# Altium schematic sheet MCU.SchDoc: STM32F3 Microcontroller
size A; DrawnBy: Brent; DocumentNumber: XXXXXX; Revision: A; SheetNumber: 2; SheetTotal: 8
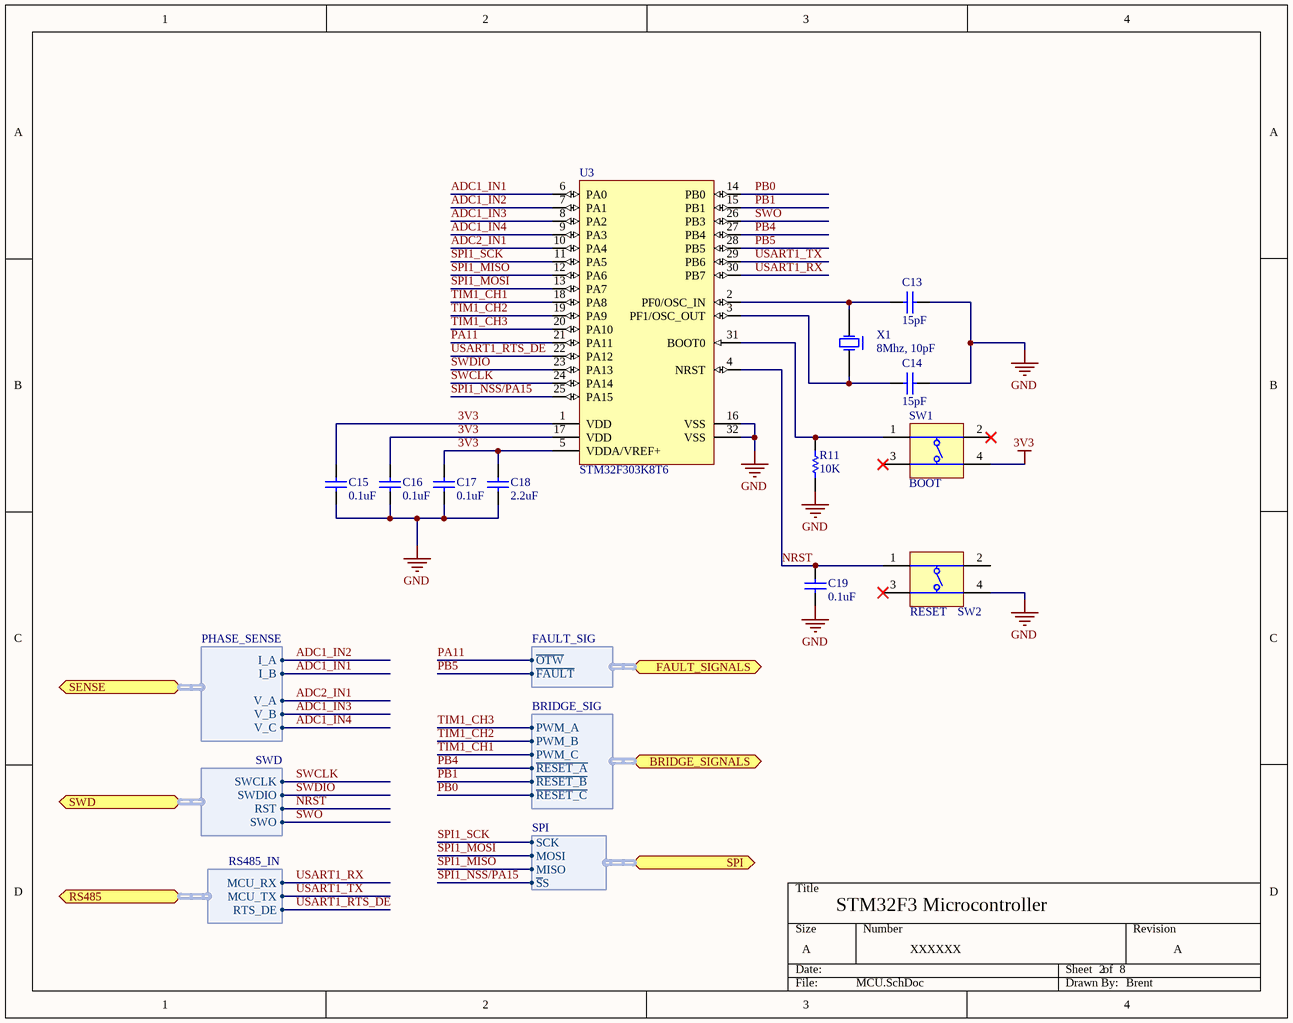
[diagram p0: MCU.SchDoc]

## Parts
C13  15pF  [CAPC0603(1608)100_L]
C14  15pF  [CAPC0603(1608)100_L]
C15  0.1uF  [CAPC0603(1608)100_L]
C16  0.1uF  [CAPC0603(1608)100_L]
C17  0.1uF  [CAPC0603(1608)100_L]
C18  2.2uF  [CAPC0603(1608)100_L]
C19  0.1uF  [CAPC0603(1608)100_L]
R11  10K  [RESC0603(1608)_N]
SW1  BOOT  [SWITCH]
SW2  RESET  [SWITCH]
U3  STM32F303K8T6  [STM-LQFP32_M]
X1  8Mhz, 10pF  [ABRA-ABM3B-4_V]

## Ports
BRIDGE_SIGNALS (harness BRIDGE_SIG), FAULT_SIGNALS (harness FAULT_SIG), RS485 (harness RS485_IN), SENSE (harness PHASE_SENSE), SPI (harness SPI), SWD (harness SWD)

## Harnesses
BRIDGE_SIG: PWM_A, PWM_B, PWM_C, ~{RESET_A}, ~{RESET_B}, ~{RESET_C}
FAULT_SIG: ~{FAULT}, ~{OTW}
PHASE_SENSE: V_C, V_B, V_A, I_B, I_A
SWD: SWCLK, SWDIO, RST, SWO
SPI: SCK, MOSI, MISO, ~{S}S
RS485_IN: MCU_TX, MCU_RX, RTS_DE

## Nets
3V3: C15.2 C16.2 C17.2 C18.1 SW1.4(T3) U3.1(VDD) U3.5(VDDA/VREF+) U3.17(VDD)
GND: C13.2 C14.2 C15.1 C16.1 C17.1 C18.2 C19.1 R11.1 SW2.4(T3) U3.16(VSS) U3.32(VSS)
ADC1_IN1: U3.6(PA0) ; port SENSE.I_B
ADC1_IN2: U3.7(PA1) ; port SENSE.I_A
ADC1_IN3: U3.8(PA2) ; port SENSE.V_B
ADC1_IN4: U3.9(PA3) ; port SENSE.V_C
ADC2_IN1: U3.10(PA4) ; port SENSE.V_A
NRST: C19.2 SW2.1(T1) U3.4(NRST) ; port SWD.RST
PA11: U3.21(PA11) ; port FAULT_SIGNALS.~{OTW}
PB0: U3.14(PB0) ; port BRIDGE_SIGNALS.~{RESET_C}
PB1: U3.15(PB1) ; port BRIDGE_SIGNALS.~{RESET_B}
PB4: U3.27(PB4) ; port BRIDGE_SIGNALS.~{RESET_A}
PB5: U3.28(PB5) ; port FAULT_SIGNALS.~{FAULT}
SPI1_MISO: U3.12(PA6) ; port SPI.MISO
SPI1_MOSI: U3.13(PA7) ; port SPI.MOSI
SPI1_NSS/PA15: U3.25(PA15) ; port SPI.~{S}S
SPI1_SCK: U3.11(PA5) ; port SPI.SCK
SWCLK: U3.24(PA14) ; port SWD.SWCLK
SWDIO: U3.23(PA13) ; port SWD.SWDIO
SWO: U3.26(PB3) ; port SWD.SWO
TIM1_CH1: U3.18(PA8) ; port BRIDGE_SIGNALS.PWM_C
TIM1_CH2: U3.19(PA9) ; port BRIDGE_SIGNALS.PWM_B
TIM1_CH3: U3.20(PA10) ; port BRIDGE_SIGNALS.PWM_A
USART1_RTS_DE: U3.22(PA12) ; port RS485.RTS_DE
USART1_RX: U3.30(PB7) ; port RS485.MCU_RX
USART1_TX: U3.29(PB6) ; port RS485.MCU_TX
NetC13_1: C13.1 U3.2(PF0/OSC_IN) X1.3(X2)
NetC14_1: C14.1 U3.3(PF1/OSC_OUT) X1.1(X1)
NetR11_2: R11.2 SW1.1(T1) U3.31(BOOT0)

Not connected (* = marked no-connect by the designer): SW1 2(T2)* 3(T3)*; SW2 2(T2) 3(T3)*; X1 2

## Library data of the parts
C13 C14 = CMP-1035-00674-1: CAP 15pF 25V ±1% 0603 (1608 Metric) Thickness 1mm SMD; Case-Metric: 1608; Case-EIA: 0603; Tolerance: Â±1%; Max Thickness: 1 mm; Technology: SMT; Value: 15pF; Rated Voltage: 25 V
C15-C17 C19 = CMP-1035-02595-1: CAP 100nF 100V ±10% 0603 (1608 Metric) Thickness 1mm SMD; Tolerance: Â±10%; Case-EIA: 0603; Case-Metric: 1608; Rated Voltage: 100 V; Value: 100nF; Technology: SMT; Max Thickness: 1 mm
C18 = CMP-1035-02767-1: CAP 2.2uF 25V ±10% 0603 (1608 Metric) Thickness 1mm SMD; Case-EIA: 0603; Tolerance: Â±10%; Case-Metric: 1608; Technology: SMT; Value: 2.2uF; Max Thickness: 1 mm; Rated Voltage: 25 V
R11 = CMP-1012-00623-1: 10K 0.1W 1% 0603 (1608 Metric)  SMD; Value: 10000.00 Ohm; Case-EIA: 0603; Case-Metric: 1608; Power: 0.1 W; Tolerance: 1 %; Technology: SMT
SW1 SW2 = DIPT-DTSM-6: Switch, SPNO Push Button SMD; Manufacturer: Diptronics; PartNumber: DTSM-61NT/R; Packing Type: Tape&Reel; Mechanical Life: 200,000 cycles; ComponentLink2URL: http://www.dip.com.tw/Products_tact.htm; ComponentLink1URL: http://www.dip.com.tw/; ComponentLink3URL: http://www.dip.com.tw/PDF/pro_tact/DTSM_G_-6_2_-V.pdf; PackageDescription: Switch, Through-Hole, 4 Leads, Body 8.5x8.5mm, Row Spacing 9.0mm, Pitch 4.5mm; ComponentLink2Description: Datasheet; ComponentLink3Description: Package Specification; ComponentLink1Description: Manufacturer URL; PackageReference: DTSM-6; Mounting Technology: Through Hole
U3 = CMP-0537-00040-1: ARM Cortex-M4 32-bit MCU, 64 KB Flash, 16 KB Internal RAM, 25 I/Os, 32-Pin LQFP, -40 to 85 degC, Tray; Supply Voltage(Vcc) min (V): 2; Internal RAM Size (kB): 16; D/A Converter: 3; FLASH Size (Prog) (kB): 64; I/Os (High Current): 25; Operating Frequency(F) (Processor speed) (MHz): 72; ComponentLink1URL: http://www.st.com/; Package Description: 32-Pin Low Profile Quad Flat Package, 7 x 7 mm Body, 0.8 mm Pitch; Mounting Technology: Surface Mount; ComponentLink2Description: Datasheet; ComponentLink2URL: http://www.st.com/st-web-ui/static/active/en/resource/technical/document/datasheet/DM00092070.pdf; Core: ARM Cortex-M4; ComponentLink1Description: Manufacturer URL; Package Reference: LQFP32; Packing: Tray; DatasheetVersion: Rev. 4
X1 = ABRA-ABM3B-4